# EAGLE schematic cs_v2.1 (EAGLE 9.6.1)

## Sheet 1 of 3
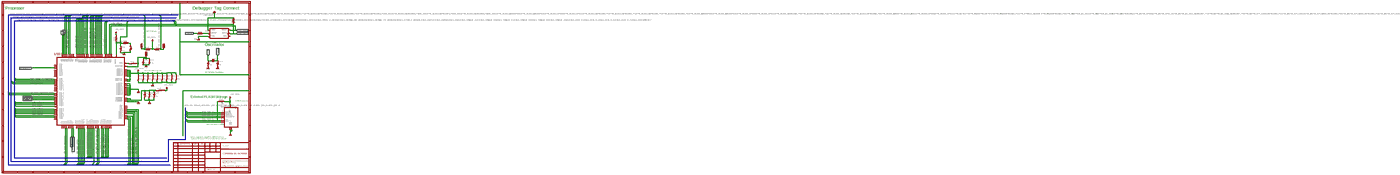
[diagram p0: schematic, sheet 1, overview]
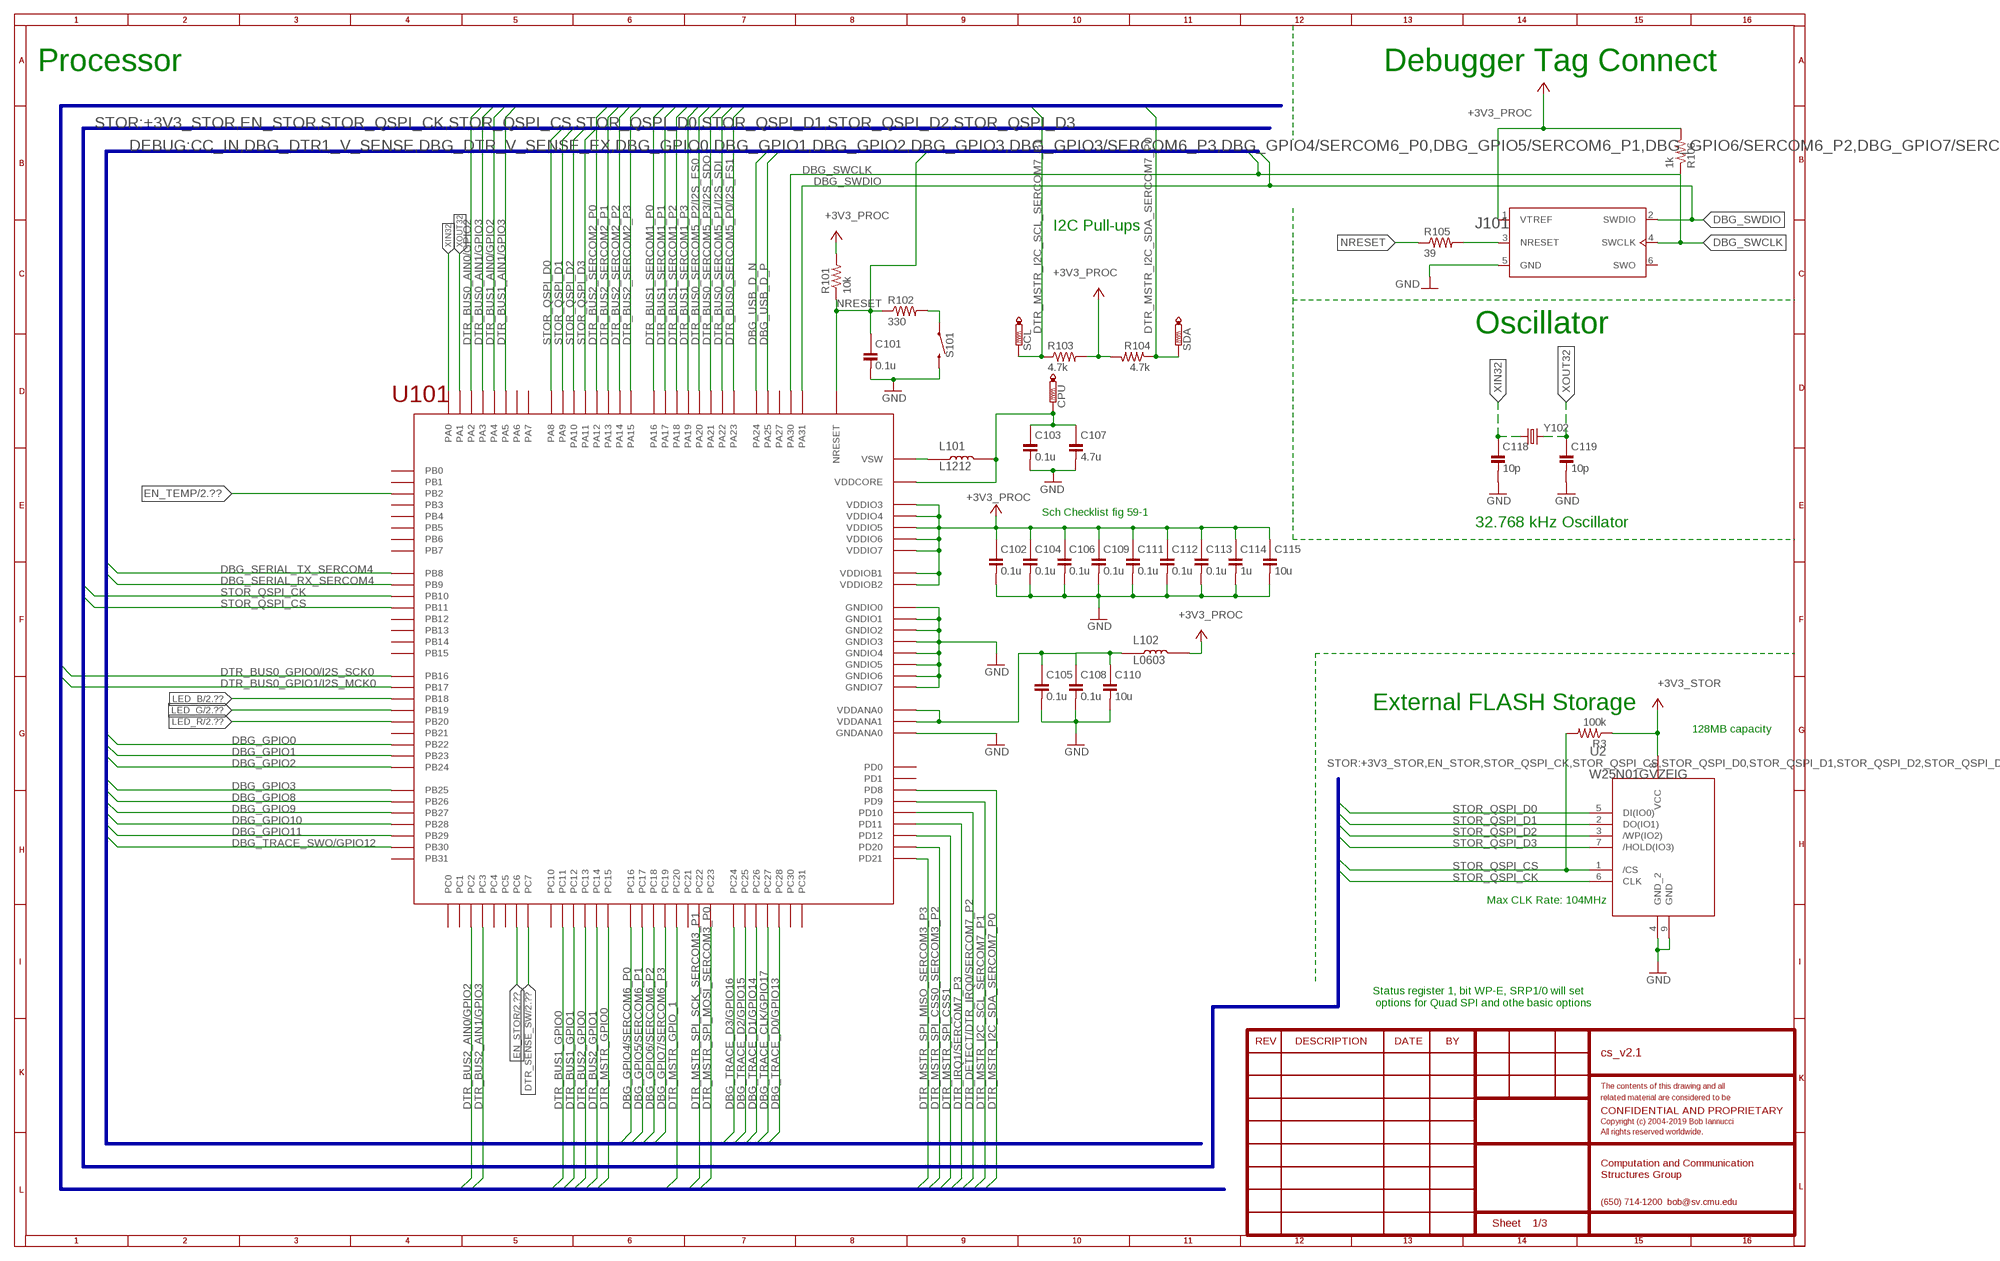
[diagram p1: schematic, sheet 1, part 1 of 4]
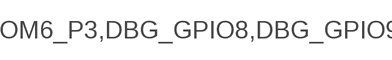
[diagram p2: schematic, sheet 1, part 2 of 4]
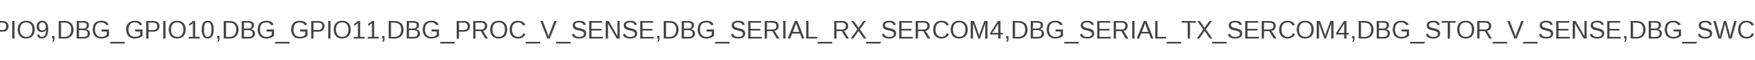
[diagram p3: schematic, sheet 1, part 3 of 4]
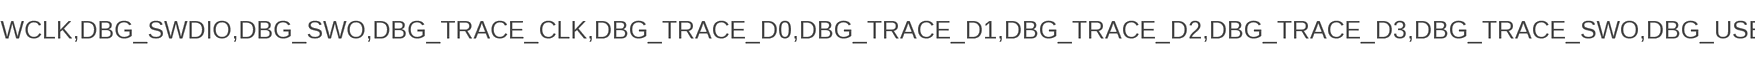
[diagram p4: schematic, sheet 1, part 4 of 4]

### Parts
C101  0.1u  C-0402  [C0402]
C102  0.1u  C-0402  [C0402]
C103  0.1u  C-0402  [C0402]
C104  0.1u  C-0402  [C0402]
C105  0.1u  C-0402  [C0402]
C106  0.1u  C-0402  [C0402]
C107  4.7u  C-0805  [C0805]
C108  0.1u  C-0402  [C0402]
C109  0.1u  C-0402  [C0402]
C110  10u  C-0805  [C0805]
C111  0.1u  C-0402  [C0402]
C112  0.1u  C-0402  [C0402]
C113  0.1u  C-0402  [C0402]
C114  1u  C-0402  [C0402]
C115  10u  C-0805  [C0805]
C118  10p  C-0402  [C0402]
C119  10p  C-0402  [C0402]
CPU  PTR1TP10SQ  [TP10SQ]
J101  J-JTAG-CORTEX-NEEDLE6-LEGS  [8.06.16_6-PIN_NEEDLE_ADAPTER_LEGS]
L101  L1212  [L1212]
L102  L0603  [L0603]
R3  100k  R-0402  [R0402]
R101  10k  R-0402  [R0402]
R102  330  R-0402  [R0402]
R103  4.7k  R-0402  [R0402]
R104  4.7k  R-0402  [R0402]
R105  39  R-0402  [R0402]
R106  1k  R-0402  [R0402]
S101  SW_EVQ-P7L01P_SPST_RA  [SW_EVQ-P7L01P]
SCL  PTR1TP10SQ  [TP10SQ]
SDA  PTR1TP10SQ  [TP10SQ]
U2  W25N01GVZEIG  [WSON-8_W15N]
U101  ATSAMD51  [TFBGA120]
Y102  ABS07-32.768KHZ-9-T  [XTAL320X150X90]

### Nets
+3V3_PROC: C102.1 C104.1 C106.1 C109.1 C111.1 C112.1 C113.1 C114.1 C115.1 J101.1(VTREF) L102.2 R101.2 R103.2 R104.2 R106.2 U101.VDDIO3 U101.VDDIO4 U101.VDDIO5 U101.VDDIO6 U101.VDDIO7 U101.VDDIOB1 U101.VDDIOB2 ; supply symbol labelled +3V3 ; also sheet 2
+3V3_STOR [power_3v3]: R3.1 U2.8(VCC) ; supply symbol labelled +3V3 ; also sheet 2
DBG_GPIO0: U101.PB22 ; also sheet 3
DBG_GPIO1: U101.PB23 ; also sheet 3
DBG_GPIO2: U101.PB24 ; also sheet 3
DBG_GPIO3: U101.PB25 ; also sheet 3
DBG_GPIO4/SERCOM6_P0: U101.PC16 ; also sheet 3
DBG_GPIO5/SERCOM6_P1: U101.PC17 ; also sheet 3
DBG_GPIO6/SERCOM6_P2: U101.PC18 ; also sheet 3
DBG_GPIO7/SERCOM6_P3: U101.PC19 ; also sheet 3
DBG_GPIO8: U101.PB26 ; also sheet 3
DBG_GPIO9: U101.PB27 ; also sheet 3
DBG_GPIO10: U101.PB28 ; also sheet 3
DBG_GPIO11: U101.PB29 ; also sheet 3
DBG_SERIAL_RX_SERCOM4: U101.PB09(PB9) ; also sheet 3
DBG_SERIAL_TX_SERCOM4: U101.PB08(PB8) ; also sheet 3
DBG_SWCLK: J101.4(SWCLK) R106.1 U101.PA30 ; also sheet 3
DBG_SWDIO: J101.2(SWDIO) U101.PA31 ; also sheet 3
DBG_TRACE_CLK/GPIO17: U101.PC27 ; also sheet 3
DBG_TRACE_D0/GPIO13: U101.PC28 ; also sheet 3
DBG_TRACE_D1/GPIO14: U101.PC26 ; also sheet 3
DBG_TRACE_D2/GPIO15: U101.PC25 ; also sheet 3
DBG_TRACE_D3/GPIO16: U101.PC24 ; also sheet 3
DBG_TRACE_SWO/GPIO12: U101.PB30 ; also sheet 3
DBG_USB_D_N [differential]: U101.PA24 ; also sheet 3
DBG_USB_D_P [differential]: U101.PA25 ; also sheet 3
DTR_BUS0_AIN0/GPIO2: U101.PA02(PA2) ; also sheet 3
DTR_BUS0_AIN1/GPIO3: U101.PA03(PA3) ; also sheet 3
DTR_BUS0_GPIO0/I2S_SCK0: U101.PB16 ; also sheet 3
DTR_BUS0_GPIO1/I2S_MCK0: U101.PB17 ; also sheet 3
DTR_BUS0_SERCOM5_P0/I2S_FS1: U101.PA23 ; also sheet 3
DTR_BUS0_SERCOM5_P1/I2S_SDI: U101.PA22 ; also sheet 3
DTR_BUS0_SERCOM5_P2/I2S_FS0: U101.PA20 ; also sheet 3
DTR_BUS0_SERCOM5_P3/I2S_SDO: U101.PA21 ; also sheet 3
DTR_BUS1_AIN0/GPIO2: U101.PA04(PA4) ; also sheet 3
DTR_BUS1_AIN1/GPIO3: U101.PA05(PA5) ; also sheet 3
DTR_BUS1_GPIO0: U101.PC11 ; also sheet 3
DTR_BUS1_GPIO1: U101.PC12 ; also sheet 3
DTR_BUS1_SERCOM1_P0: U101.PA16 ; also sheet 3
DTR_BUS1_SERCOM1_P1: U101.PA17 ; also sheet 3
DTR_BUS1_SERCOM1_P2: U101.PA18 ; also sheet 3
DTR_BUS1_SERCOM1_P3: U101.PA19 ; also sheet 3
DTR_BUS2_AIN0/GPIO2: U101.PC02(PC2) ; also sheet 3
DTR_BUS2_AIN1/GPIO3: U101.PC03(PC3) ; also sheet 3
DTR_BUS2_GPIO0: U101.PC13 ; also sheet 3
DTR_BUS2_GPIO1: U101.PC14 ; also sheet 3
DTR_BUS2_SERCOM2_P0: U101.PA12 ; also sheet 3
DTR_BUS2_SERCOM2_P1: U101.PA13 ; also sheet 3
DTR_BUS2_SERCOM2_P2: U101.PA14 ; also sheet 3
DTR_BUS2_SERCOM2_P3: U101.PA15 ; also sheet 3
DTR_DETECT/DTR_IRQ0/SERCOM7_P2: U101.PD10 ; also sheet 3
DTR_IRQ1/SERCOM7_P3: U101.PD11 ; also sheet 3
DTR_MSTR_GPIO0: U101.PC15 ; also sheet 3
DTR_MSTR_GPIO_1: U101.PC20
DTR_MSTR_I2C_SCL_SERCOM7_P1: R103.1 SCL.TP U101.PD09(PD9) ; also sheet 2,3
DTR_MSTR_I2C_SDA_SERCOM7_P0: R104.1 SDA.TP U101.PD08(PD8) ; also sheet 2,3
DTR_MSTR_SPI_CSS0_SERCOM3_P2: U101.PD20 ; also sheet 3
DTR_MSTR_SPI_CSS1: U101.PD12 ; also sheet 3
DTR_MSTR_SPI_MISO_SERCOM3_P3: U101.PD21 ; also sheet 3
DTR_MSTR_SPI_MOSI_SERCOM3_P0: U101.PC23 ; also sheet 3
DTR_MSTR_SPI_SCK_SERCOM3_P1: U101.PC22 ; also sheet 3
DTR_SENSE_SW: U101.PC07(PC7) ; also sheet 2
EN_STOR: U101.PC06(PC6) ; also sheet 2
EN_TEMP: U101.PB02(PB2) ; also sheet 2
GND: C101.2 C102.2 C103.2 C104.2 C105.2 C106.2 C107.2 C108.2 C109.2 C110.2 C111.2 C112.2 C113.2 C114.2 C115.2 C118.2 C119.2 J101.5(GND) S101.2_1 S101.2_2 U2.4(GND_2) U2.9(GND) U101.GNDANA0 U101.GNDIO0 U101.GNDIO1 U101.GNDIO2 U101.GNDIO3 U101.GNDIO4 U101.GNDIO5 U101.GNDIO6 U101.GNDIO7 ; also sheet 2,3
JTAG_NRESET: J101.3(NRESET) R105.2
LED_B: U101.PB18 ; also sheet 2
LED_G: U101.PB19 ; also sheet 2
LED_R: U101.PB20 ; also sheet 2
N$5: R102.2 S101.1_1 S101.1_2
NRESET: C101.1 R101.1 R102.1 R105.1 U101.NRESET ; also sheet 3
STOR_QSPI_CK: U2.6(CLK) U101.PB10
STOR_QSPI_CS: R3.2 U2.1(/CS) U101.PB11
STOR_QSPI_D0: U2.5(DI(IO0)) U101.PA08(PA8)
STOR_QSPI_D1: U2.2(DO(IO1)) U101.PA09(PA9)
STOR_QSPI_D2: U2.3(/WP(IO2)) U101.PA10
STOR_QSPI_D3: U2.7(/HOLD(IO3)) U101.PA11
VDDANA: C105.1 C108.1 C110.1 L102.1 U101.VDDANA0 U101.VDDANA1
VDDCORE: C103.1 C107.1 CPU.TP L101.P$2 U101.VDDCORE
VSW: L101.P$1 U101.VSW
XIN32: C118.1 U101.PA00(PA0) Y102.1
XOUT32: C119.1 U101.PA01(PA1) Y102.2
Unconnected: J101.6(SWO) U101.PA06(PA6) U101.PA07(PA7) U101.PA27 U101.PB00(PB0) U101.PB01(PB1) U101.PB03(PB3) U101.PB04(PB4) U101.PB05(PB5) U101.PB06(PB6) U101.PB07(PB7) U101.PB12 U101.PB13 U101.PB14 U101.PB15 U101.PB21 U101.PB31 U101.PC00(PC0) U101.PC01(PC1) U101.PC04(PC4) U101.PC05(PC5) U101.PC10 U101.PC21 U101.PC30 U101.PC31 U101.PD00(PD0) U101.PD01(PD1)

### Buses
STOR:+3V3_STOR,EN_STOR,STOR_QSPI_CK,STOR_QSPI_CS,STOR_QSPI_D0,STOR_QSPI_D1,STOR_QSPI_D2,STOR_QSPI_D3
DTR:+3V3_DTR,+3V3_DTR_SENSE-,DTR,DTR_BUS0_AIN0/GPIO2,DTR_BUS0_AIN1/GPIO3,DTR_BUS0_GPIO0,DTR_BUS0_GPIO0/I2S_SCK0,DTR_BUS0_GPIO1,DTR_BUS0_GPIO1/I2S_MCK0,DTR_BUS0_GPIO4/I2S_SCK1,DTR_BUS0_GPIO5/I2S_MCK1,DTR_BUS0_SERCOM0_P0,DTR_BUS0_SERCOM0_P1,DTR_BUS0_SERCOM0_P2,DTR_BUS0_SERCOM0_P3,DTR_BUS0_SERCOM5_P0/I2S_FS1,DTR_BUS0_SERCOM5_P1/I2S_SDI,DTR_BUS0_SERCOM5_P2/I2S_FS0,DTR_BUS0_SERCOM5_P3/I2S_SDO,DTR_BUS1_AIN0/GPIO2,DTR_BUS1_AIN1/GPIO3,DTR_BUS1_GPIO0,DTR_BUS1_GPIO1,DTR_BUS1_SERCOM1_P0,DTR_BUS1_SERCOM1_P1,DTR_BUS1_SERCOM1_P2,DTR_BUS1_SERCOM1_P3,DTR_BUS2_AIN0/GPIO2,DTR_BUS2_AIN1/GPIO3,DTR_BUS2_GPIO0,DTR_BUS2_GPIO1,DTR_BUS2_SERCOM2_P0,DTR_BUS2_SERCOM2_P1,DTR_BUS2_SERCOM2_P2,DTR_BUS2_SERCOM2_P3,DTR_BUS3_AIN0,DTR_BUS3_AIN1,DTR_BUS3_GPIO0,DTR_BUS3_GPIO1,DTR_DETECT/DTR_IRQ0,DTR_DETECT/DTR_IRQ0/SERCOM7_P2,DTR_DTR0_V_SENSE,DTR_IRQ1/SERCOM7_P3,DTR_MASTER_I2C_SCL,DTR_MASTER_I2C_SDA,DTR_MASTER_IRQ,DTR_MSTR_GPIO0,DTR_MSTR_GPIO_1,DTR_MSTR_I2C_SCL_SERCOM7_P1,DTR_MSTR_I2C_SDA_SERCOM7_P0,DTR_MSTR_SPI_CSS0_SERCOM3_P2,DTR_MSTR_SPI_CSS1,DTR_MSTR_SPI_MISO_SERCOM3_P3,DTR_MSTR_SPI_MOSI_SERCOM3_P0,DTR_MSTR_SPI_SCK_SERCOM3_P1,DTR_SENSE_SW
DEBUG:CC_IN,DBG_DTR1_V_SENSE,DBG_DTR_V_SENSE_EX,DBG_GPIO0,DBG_GPIO1,DBG_GPIO2,DBG_GPIO3,DBG_GPIO3/SERCOM6_P3,DBG_GPIO4/SERCOM6_P0,DBG_GPIO5/SERCOM6_P1,DBG_GPIO6/SERCOM6_P2,DBG_GPIO7/SERCOM6_P3,DBG_GPIO8,DBG_GPIO9,DBG_GPIO10,DBG_GPIO11,DBG_PROC_V_SENSE,DBG_SERIAL_RX_SERCOM4,DBG_SERIAL_TX_SERCOM4,DBG_STOR_V_SENSE,DBG_SWCLK,DBG_SWDIO,DBG_SWO,DBG_TRACE_CLK,DBG_TRACE_D0,DBG_TRACE_D1,DBG_TRACE_D2,DBG_TRACE_D3,DBG_TRACE_SWO,DBG_USB_D-,DBG_USB_D+,DBG_USB_D_N,DBG_USB_D_P,DBG_VDD,NRESET

### Notes on the sheet
- Processor | Debugger Tag Connect
- I2C Pull-ups
- Oscillator
- Sch Checklist fig 59-1
- 32.768 kHz Oscillator
- External FLASH Storage
- 128MB capacity
- Max CLK Rate: 104MHz
- Status register 1, bit WP-E, SRP1/0 will set
   options for Quad SPI and othe basic options

## Sheet 2 of 3
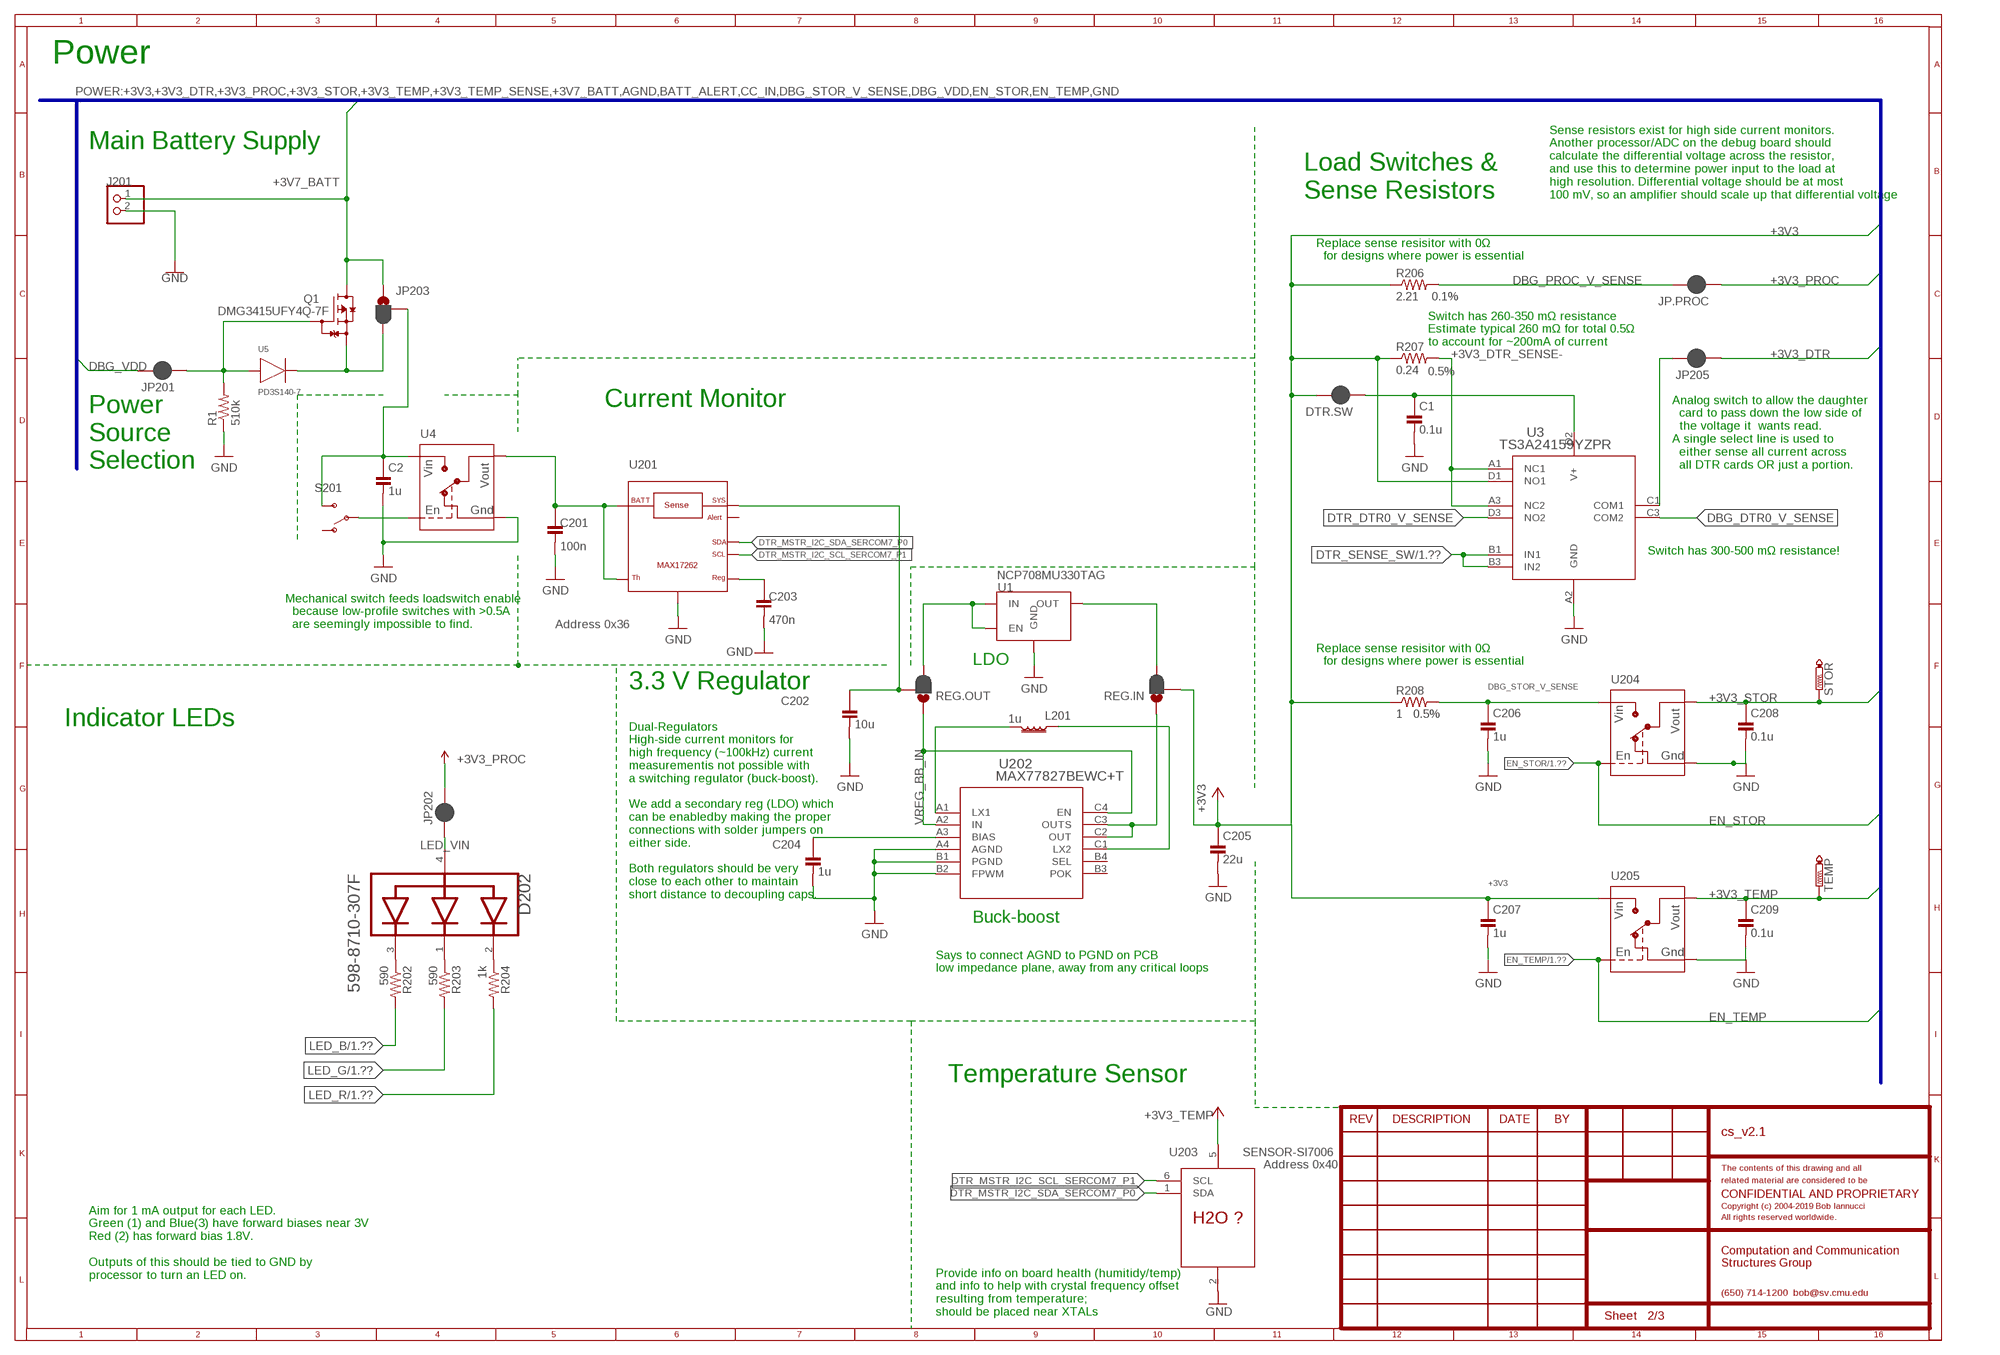
[diagram p5: schematic, sheet 2]

### Parts
C1  0.1u  C-0402  [C0402]
C2  1u  C-0402  [C0402]
C201  100n  C-0402  [C0402]
C202  10u  C-0603  [C0603]
C203  470n  C-0402  [C0402]
C204  1u  C-0402  [C0402]
C205  22u  C-0805  [C0805]
C206  1u  C-0402  [C0402]
C207  1u  C-0402  [C0402]
C208  0.1u  C-0402  [C0402]
C209  0.1u  C-0402  [C0402]
D202  DIALIGHT_RGBLED_598-8710-307FDIALIGHT_598-8710-307F_0_0  [DIALIGHT_0606_598-8710-307F_0]
DTR.SW  JUMPER-SMT_2_NC_PASTE_NO-SILK  [SMT-JUMPER_2_NC_PASTE_NO-SILK]
J201  J-JST2-SMT-RA  [JST-PH-2-SMT-RA]
JP201  JUMPER-SMT_2_NC_PASTE_NO-SILK  [SMT-JUMPER_2_NC_PASTE_NO-SILK]
JP202  JUMPER-SMT_2_NC_PASTE_NO-SILK  [SMT-JUMPER_2_NC_PASTE_NO-SILK]
JP203  JUMPER-SMT_3_1-NC_PASTE_NO-SILK  [SMT-JUMPER_3_1-NC_PASTE_NO-SILK]
JP205  JUMPER-SMT_2_NC_PASTE_NO-SILK  [SMT-JUMPER_2_NC_PASTE_NO-SILK]
JP.PROC  JUMPER-SMT_2_NC_PASTE_NO-SILK  [SMT-JUMPER_2_NC_PASTE_NO-SILK]
L201  1u  XAL40  [XAL40]
Q1  DMG3415UFY4Q-7F  [X2-DFN2015-3]
R1  510k  R-0402  [R0402]
R202  590  R-0402  [R0402]
R203  590  R-0402  [R0402]
R204  1k  R-0402  [R0402]
R206  2.21  R-0603  [R0603]
R207  0.24  R-0402  [R0402]
R208  1  R-0603  [R0603]
REG.IN  JUMPER-SMT_3_1-NC_PASTE_NO-SILK  [SMT-JUMPER_3_1-NC_PASTE_NO-SILK]
REG.OUT  JUMPER-SMT_3_1-NC_PASTE_NO-SILK  [SMT-JUMPER_3_1-NC_PASTE_NO-SILK]
S201  SLIDESWITCH-SPDT-SMD-RIGHT-ANGLE  [SWITCH_SPST_SMD_A]
STOR  PTR1TP10SQ  [TP10SQ]
TEMP  PTR1TP10SQ  [TP10SQ]
U1  NCP708MU330TAG  LDO_ONSEMI_NCP708  [UDFN6_NCP708]]
U3  TS3A24159YZPR  [DSBGA10]
U4  LOADSWITCH-MIC94164  [WLCSP6_2X3]
U5  PD3S140-7  [POWERDI323]
U201  COULOMB-MAX17262  [BGA9N40P3X3_144X146X69N]
U202  MAX77827BEWC+T  [12-WLP]
U203  SENSOR-SI7006  [DFN-06]
U204  LOADSWITCH-MIC94164  [WLCSP6_2X3]
U205  LOADSWITCH-MIC94164  [WLCSP6_2X3]

### Nets
+3V3 [power_3v3]: C205.1 C207.1 DTR.SW.2 R206.1 R207.1 R208.1 REG.IN.2 U3.D1(NO1) U205.A2(VIN) U205.B2(VIN) ; also sheet 3
+3V3_DTR [power_3v3]: JP205.1 ; also sheet 3
+3V3_DTR.SW: JP205.2 U3.C1(COM1)
+3V3_DTR_SENSE-: R207.2 U3.A1(NC1) U3.A3(NC2)
+3V3_PROC: JP202.2 JP.PROC.1 ; supply symbol labelled VIN ; also sheet 1
+3V3_STOR [power_3v3]: C208.1 STOR.TP U204.A1(VOUT) U204.B1(VOUT) ; also sheet 1
+3V3_TEMP: C209.1 TEMP.TP U203.5(V) U205.A1(VOUT) U205.B1(VOUT) ; supply symbol labelled +3V3
+3V7_BATT [power_3v3]: J201.1 JP203.1 Q1.3-1(D) Q1.3-2(D) ; also sheet 3
BB_LX1: L201.2 U202.A1(LX1)
BB_LX2: L201.1 U202.C1(LX2)
BB_REG_OUT [power_3v3]: REG.IN.1 U202.C2(OUT) U202.C3(OUTS)
CC_IN [power_3v3]: C201.1 U4.A1(VOUT) U4.B1(VOUT) U201.A1(TH) U201.A2(BATT)
DBG_DTR0_V_SENSE: U3.C3(COM2) ; also sheet 3
DBG_PROC_V_SENSE: JP.PROC.2 R206.2 ; also sheet 3
DBG_STOR_V_SENSE: C206.1 R208.2 U204.A2(VIN) U204.B2(VIN) ; also sheet 3
DBG_VDD [power_3v3]: JP201.2 ; also sheet 3
DTR_DTR0_V_SENSE: U3.D3(NO2) ; also sheet 3
DTR_MSTR_I2C_SCL_SERCOM7_P1: U201.B1(SCL) U203.6(SCL) ; also sheet 1,3
DTR_MSTR_I2C_SDA_SERCOM7_P0: U201.C1(SDA) U203.1(SDA) ; also sheet 1,3
DTR_SENSE_SW: U3.B1(IN1) U3.B3(IN2) ; also sheet 1
EN_STOR: U204.C2(ENABLE) ; also sheet 1
EN_TEMP: U205.C2(ENABLE) ; also sheet 1
GND: C1.2 C2.2 C201.2 C202.2 C203.2 C204.2 C205.2 C206.2 C207.2 C208.2 C209.2 J201.2 R1.1 U1.2(GND) U1.3(GND) U1.7(GND) U3.A2(GND) U4.C1(GND) U201.C3(GND) U202.A4(AGND) U202.B1(PGND) U202.B2(FPWM) U203.2(GND) U204.C1(GND) U205.C1(GND) ; also sheet 1,3
LDO_REG_OUT: REG.IN.3 U1.4(OUT) U1.5(OUT)
LED_B: R202.2 ; also sheet 1
LED_G: R203.2 ; also sheet 1
LED_R: R204.2 ; also sheet 1
LED_VIN: D202.4(COMMON_ANODE) JP202.1
N$2: JP203.3 Q1.2(S) U5.2(N)
N$4: D202.3(BLUE_CATHODE) R202.1
N$12: D202.1(GREEN_CATHODE) R203.1
N$13: C203.1 U201.C2(REG)
N$14: D202.2(RED_CATHODE) R204.1
N$17 [power_3v3]: C1.1 DTR.SW.1 U3.D2(V+)
REG_LDO_IN: REG.OUT.3 U1.1(EN) U1.6(IN)
V.SRC: C2.1 JP203.2 S201.3(S) U4.A2(VIN) U4.B2(VIN)
V.SRC.EN: S201.2(P) U4.C2(ENABLE)
V_SEL_IN_B [power_3v3]: JP201.1 Q1.1(G) R1.2 U5.1(P)
VREG_BB_IN [power_3v3]: REG.OUT.1 U202.A2(IN) U202.C4(EN)
VREG_BIAS: C204.1 U202.A3(BIAS)
VREG_IN [power_3v3]: C202.1 REG.OUT.2 U201.B3(SYS)
Unconnected: S201.1(O) U201.B2(ALRT) U202.B3(POK) U202.B4(SEL)

### Buses
POWER:+3V3,+3V3_DTR,+3V3_PROC,+3V3_STOR,+3V3_TEMP,+3V3_TEMP_SENSE,+3V7_BATT,AGND,BATT_ALERT,CC_IN,DBG_STOR_V_SENSE,DBG_VDD,EN_STOR,EN_TEMP,GND

### Notes on the sheet
- Power
- Main Battery Supply
- Load Switches &
  Sense Resistors
- Sense resistors exist for high side current monitors.
  Another processor/ADC on the debug board should
  calculate the differential voltage across the resistor, 
  and use this to determine power input to the load at
  high resolution. Differential voltage should be at most 
  100 mV, so an amplifier should scale up that differential voltage
- Replace sense resisitor with 0Ω
    for designs where power is essential
- Switch has 260-350 mΩ resistance
  Estimate typical 260 mΩ for total 0.5Ω
  to account for ~200mA of current
- Current Monitor
- Power 
  Source
  Selection
- Analog switch to allow the daughter 
    card to pass down the low side of 
    the voltage it  wants read. 
  A single select line is used to 
    either sense all current across
    all DTR cards OR just a portion.
- Switch has 300-500 mΩ resistance!
- Mechanical switch feeds loadswitch enable
    because low-profile switches with >0.5A
    are seemingly impossible to find.
- Address 0x36
- LDO
- Replace sense resisitor with 0Ω
    for designs where power is essential
- 3.3 V Regulator
- Indicator LEDs
- Dual-Regulators
  High-side current monitors for 
  high frequency (~100kHz) current 
  measurementis not possible with 
  a switching regulator (buck-boost).
  
  We add a secondary reg (LDO) which 
  can be enabledby making the proper 
  connections with solder jumpers on 
  either side.
  
  Both regulators should be very 
  close to each other to maintain 
  short distance to decoupling caps.
- Buck-boost
- Says to connect AGND to PGND on PCB
  low impedance plane, away from any critical loops
- Temperature Sensor
- Address 0x40
- Aim for 1 mA output for each LED.
  Green (1) and Blue(3) have forward biases near 3V
  Red (2) has forward bias 1.8V.
  
  Outputs of this should be tied to GND by 
  processor to turn an LED on.
- Provide info on board health (humitidy/temp) 
  and info to help with crystal frequency offset
  resulting from temperature; 
  should be placed near XTALs

## Sheet 3 of 3
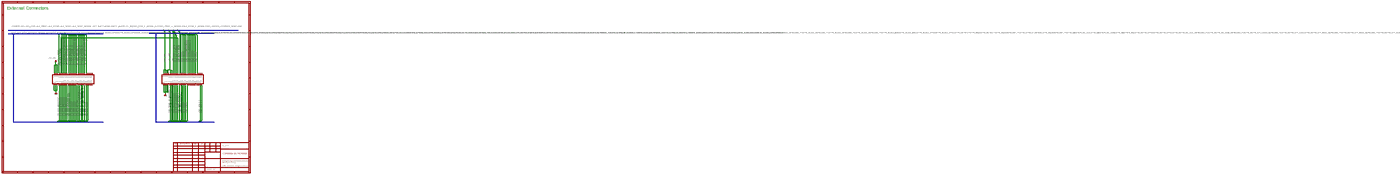
[diagram p6: schematic, sheet 3, overview]
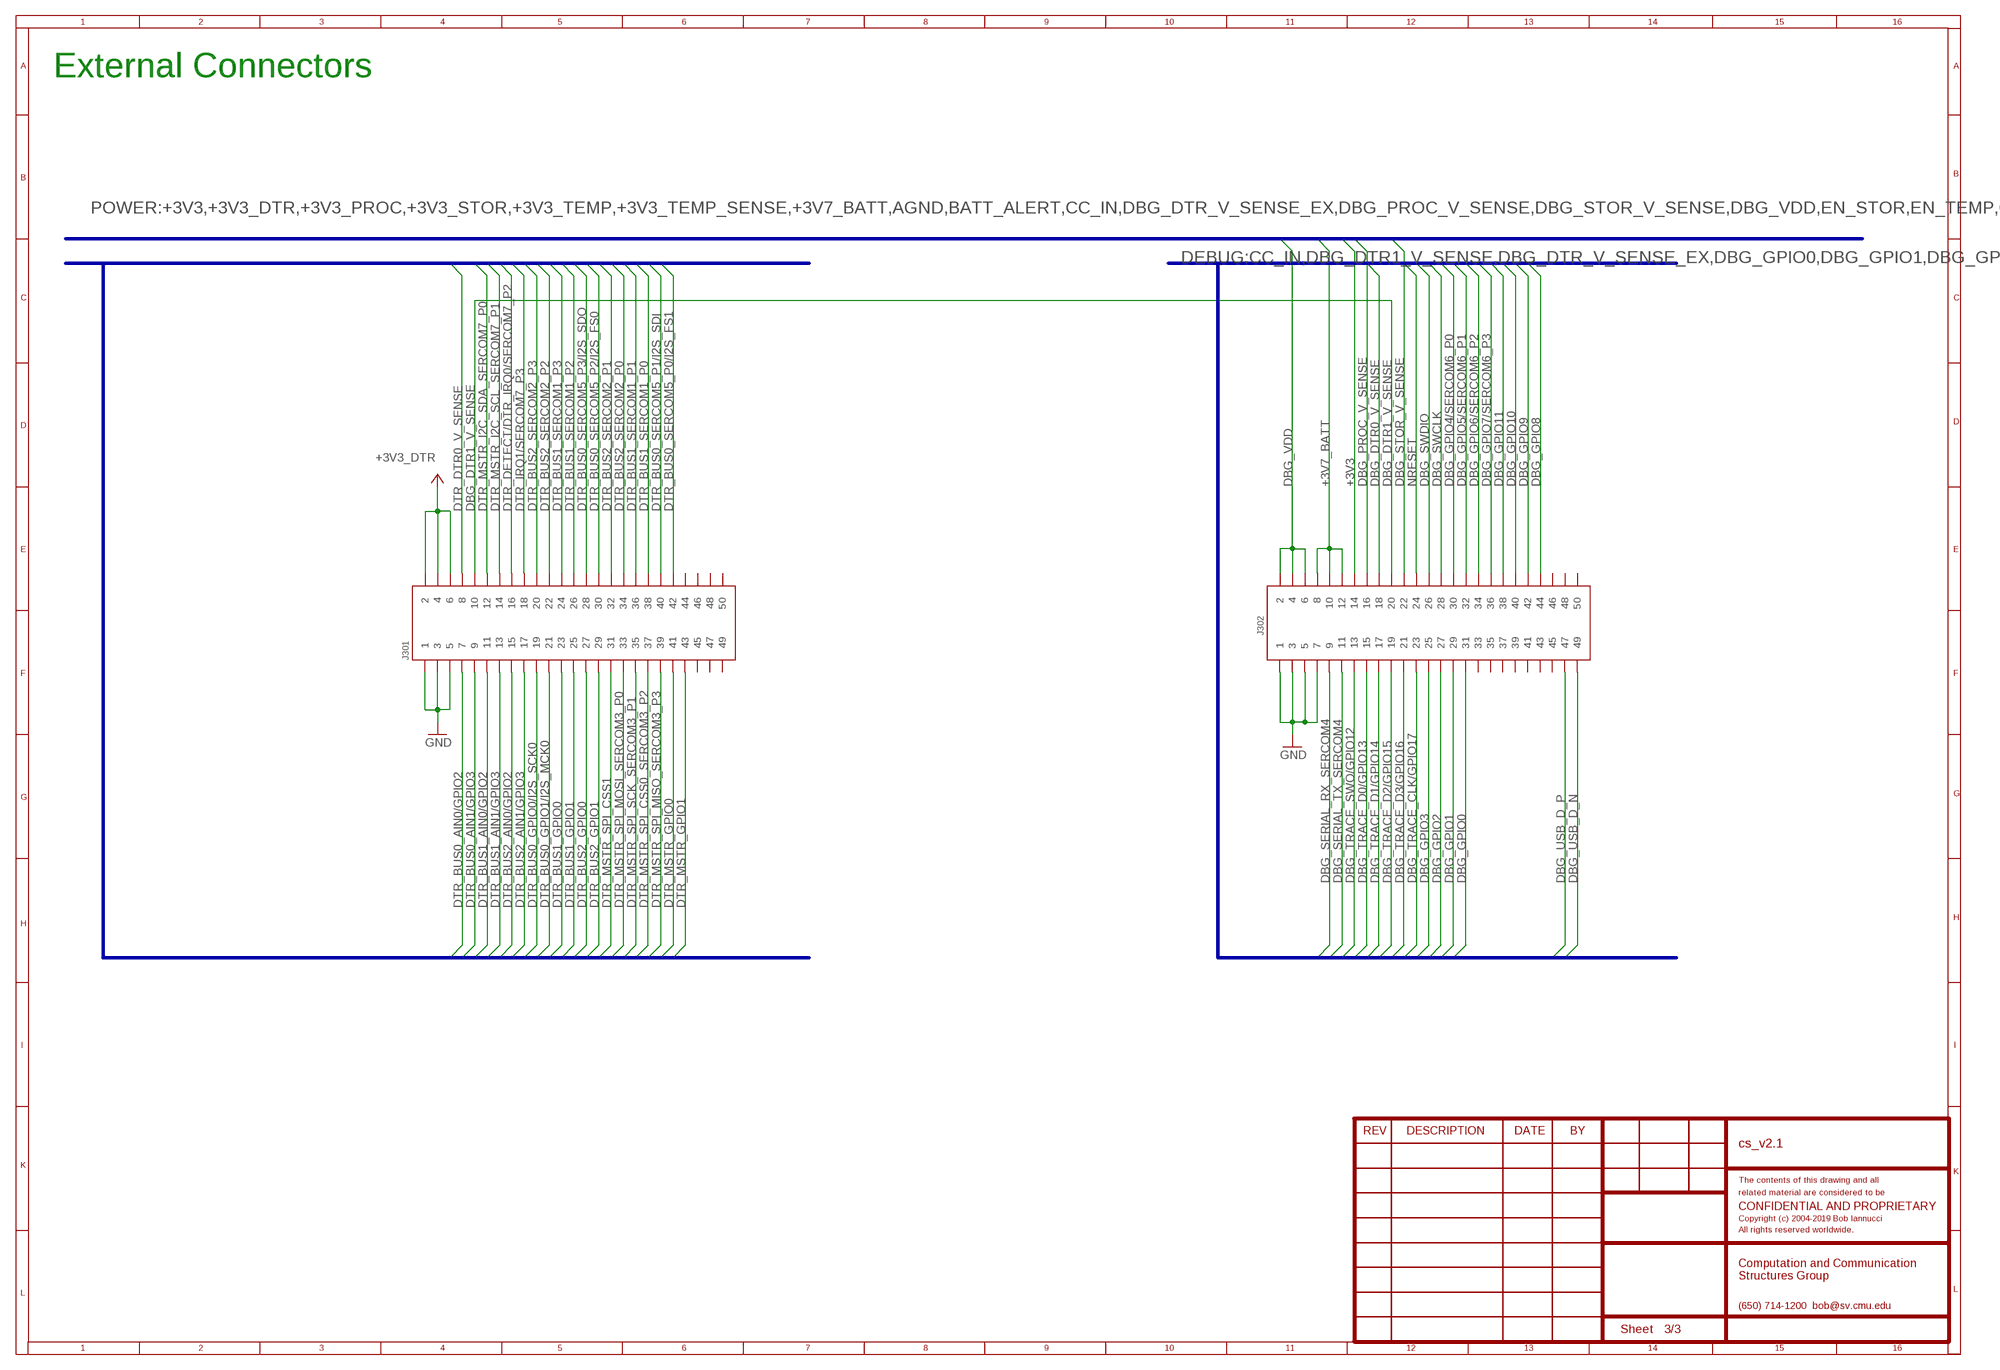
[diagram p7: schematic, sheet 3, part 1 of 4]
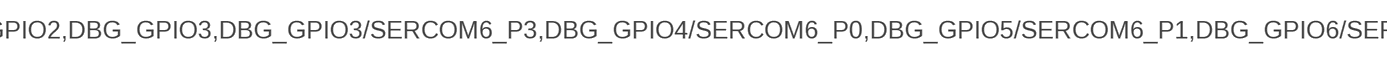
[diagram p8: schematic, sheet 3, part 2 of 4]
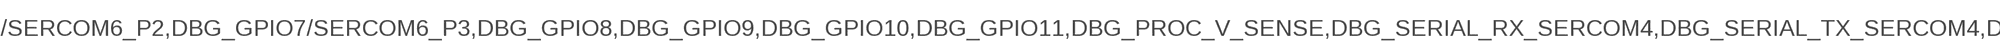
[diagram p9: schematic, sheet 3, part 3 of 4]
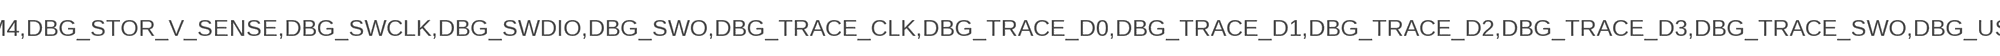
[diagram p10: schematic, sheet 3, part 4 of 4]

### Parts
J301  HIROSE-DF40_50-PIN_CONNECTORS-RECEPTACLE  [HRS_DF40HC(4.0)-50DS-0.4V(51)]
J302  HIROSE-DF40_50-PIN_CONNECTORS-RECEPTACLE  [HRS_DF40HC(4.0)-50DS-0.4V(51)]

### Nets
+3V3 [power_3v3]: J302.14 ; also sheet 2
+3V3_DTR [power_3v3]: J301.2 J301.4 J301.6 ; supply symbol labelled +3V3 ; also sheet 2
+3V7_BATT [power_3v3]: J302.8 J302.10 J302.12 ; also sheet 2
DBG_DTR0_V_SENSE: J302.18 ; also sheet 2
DBG_DTR1_V_SENSE: J301.10 J302.20
DBG_GPIO0: J302.31 ; also sheet 1
DBG_GPIO1: J302.29 ; also sheet 1
DBG_GPIO2: J302.27 ; also sheet 1
DBG_GPIO3: J302.25 ; also sheet 1
DBG_GPIO4/SERCOM6_P0: J302.30 ; also sheet 1
DBG_GPIO5/SERCOM6_P1: J302.32 ; also sheet 1
DBG_GPIO6/SERCOM6_P2: J302.34 ; also sheet 1
DBG_GPIO7/SERCOM6_P3: J302.36 ; also sheet 1
DBG_GPIO8: J302.44 ; also sheet 1
DBG_GPIO9: J302.42 ; also sheet 1
DBG_GPIO10: J302.40 ; also sheet 1
DBG_GPIO11: J302.38 ; also sheet 1
DBG_PROC_V_SENSE: J302.16 ; also sheet 2
DBG_SERIAL_RX_SERCOM4: J302.9 ; also sheet 1
DBG_SERIAL_TX_SERCOM4: J302.11 ; also sheet 1
DBG_STOR_V_SENSE: J302.22 ; also sheet 2
DBG_SWCLK: J302.28 ; also sheet 1
DBG_SWDIO: J302.26 ; also sheet 1
DBG_TRACE_CLK/GPIO17: J302.23 ; also sheet 1
DBG_TRACE_D0/GPIO13: J302.15 ; also sheet 1
DBG_TRACE_D1/GPIO14: J302.17 ; also sheet 1
DBG_TRACE_D2/GPIO15: J302.19 ; also sheet 1
DBG_TRACE_D3/GPIO16: J302.21 ; also sheet 1
DBG_TRACE_SWO/GPIO12: J302.13 ; also sheet 1
DBG_USB_D_N [differential]: J302.49 ; also sheet 1
DBG_USB_D_P [differential]: J302.47 ; also sheet 1
DBG_VDD [power_3v3]: J302.2 J302.4 J302.6 ; also sheet 2
DTR_BUS0_AIN0/GPIO2: J301.7 ; also sheet 1
DTR_BUS0_AIN1/GPIO3: J301.9 ; also sheet 1
DTR_BUS0_GPIO0/I2S_SCK0: J301.19 ; also sheet 1
DTR_BUS0_GPIO1/I2S_MCK0: J301.21 ; also sheet 1
DTR_BUS0_SERCOM5_P0/I2S_FS1: J301.42 ; also sheet 1
DTR_BUS0_SERCOM5_P1/I2S_SDI: J301.40 ; also sheet 1
DTR_BUS0_SERCOM5_P2/I2S_FS0: J301.30 ; also sheet 1
DTR_BUS0_SERCOM5_P3/I2S_SDO: J301.28 ; also sheet 1
DTR_BUS1_AIN0/GPIO2: J301.11 ; also sheet 1
DTR_BUS1_AIN1/GPIO3: J301.13 ; also sheet 1
DTR_BUS1_GPIO0: J301.23 ; also sheet 1
DTR_BUS1_GPIO1: J301.25 ; also sheet 1
DTR_BUS1_SERCOM1_P0: J301.38 ; also sheet 1
DTR_BUS1_SERCOM1_P1: J301.36 ; also sheet 1
DTR_BUS1_SERCOM1_P2: J301.26 ; also sheet 1
DTR_BUS1_SERCOM1_P3: J301.24 ; also sheet 1
DTR_BUS2_AIN0/GPIO2: J301.15 ; also sheet 1
DTR_BUS2_AIN1/GPIO3: J301.17 ; also sheet 1
DTR_BUS2_GPIO0: J301.27 ; also sheet 1
DTR_BUS2_GPIO1: J301.29 ; also sheet 1
DTR_BUS2_SERCOM2_P0: J301.34 ; also sheet 1
DTR_BUS2_SERCOM2_P1: J301.32 ; also sheet 1
DTR_BUS2_SERCOM2_P2: J301.22 ; also sheet 1
DTR_BUS2_SERCOM2_P3: J301.20 ; also sheet 1
DTR_DETECT/DTR_IRQ0/SERCOM7_P2: J301.16 ; also sheet 1
DTR_DTR0_V_SENSE: J301.8 ; also sheet 2
DTR_IRQ1/SERCOM7_P3: J301.18 ; also sheet 1
DTR_MSTR_GPIO0: J301.41 ; also sheet 1
DTR_MSTR_GPIO1: J301.43
DTR_MSTR_I2C_SCL_SERCOM7_P1: J301.14 ; also sheet 1,2
DTR_MSTR_I2C_SDA_SERCOM7_P0: J301.12 ; also sheet 1,2
DTR_MSTR_SPI_CSS0_SERCOM3_P2: J301.37 ; also sheet 1
DTR_MSTR_SPI_CSS1: J301.31 ; also sheet 1
DTR_MSTR_SPI_MISO_SERCOM3_P3: J301.39 ; also sheet 1
DTR_MSTR_SPI_MOSI_SERCOM3_P0: J301.33 ; also sheet 1
DTR_MSTR_SPI_SCK_SERCOM3_P1: J301.35 ; also sheet 1
GND: J301.1 J301.3 J301.5 J302.1 J302.3 J302.5 J302.7 ; also sheet 1,2
NRESET: J302.24 ; also sheet 1
Unconnected: J301.44 J301.45 J301.46 J301.47 J301.48 J301.49 J301.50 J302.33 J302.35 J302.37 J302.39 J302.41 J302.43 J302.45 J302.46 J302.48 J302.50

### Buses
POWER:+3V3,+3V3_DTR,+3V3_PROC,+3V3_STOR,+3V3_TEMP,+3V3_TEMP_SENSE,+3V7_BATT,AGND,BATT_ALERT,CC_IN,DBG_DTR_V_SENSE_EX,DBG_PROC_V_SENSE,DBG_STOR_V_SENSE,DBG_VDD,EN_STOR,EN_TEMP,GND
DTR:+3V3_DTR,+3V3_DTR_SENSE-,DTR,DTR_BUS0_AIN0/GPIO2,DTR_BUS0_AIN1/GPIO3,DTR_BUS0_GPIO0,DTR_BUS0_GPIO0/I2S_SCK0,DTR_BUS0_GPIO1,DTR_BUS0_GPIO1/I2S_MCK0,DTR_BUS0_GPIO4/I2S_SCK1,DTR_BUS0_GPIO5/I2S_MCK1,DTR_BUS0_SERCOM0_P0,DTR_BUS0_SERCOM0_P1,DTR_BUS0_SERCOM0_P2,DTR_BUS0_SERCOM0_P3,DTR_BUS0_SERCOM5_P0/I2S_FS1,DTR_BUS0_SERCOM5_P1/I2S_SDI,DTR_BUS0_SERCOM5_P2/I2S_FS0,DTR_BUS0_SERCOM5_P3/I2S_SDO,DTR_BUS1_AIN0/GPIO2,DTR_BUS1_AIN1/GPIO3,DTR_BUS1_GPIO0,DTR_BUS1_GPIO1,DTR_BUS1_SERCOM1_P0,DTR_BUS1_SERCOM1_P1,DTR_BUS1_SERCOM1_P2,DTR_BUS1_SERCOM1_P3,DTR_BUS2_AIN0/GPIO2,DTR_BUS2_AIN1/GPIO3,DTR_BUS2_GPIO0,DTR_BUS2_GPIO1,DTR_BUS2_SERCOM2_P0,DTR_BUS2_SERCOM2_P1,DTR_BUS2_SERCOM2_P2,DTR_BUS2_SERCOM2_P3,DTR_BUS3_AIN0,DTR_BUS3_AIN1,DTR_BUS3_GPIO0,DTR_BUS3_GPIO1,DTR_DETECT/DTR_IRQ0,DTR_DETECT/DTR_IRQ0/SERCOM7_P2,DTR_DTR0_V_SENSE,DTR_IRQ1/SERCOM7_P3,DTR_MASTER_I2C_SCL,DTR_MASTER_I2C_SDA,DTR_MASTER_IRQ,DTR_MSTR_GPIO0,DTR_MSTR_GPIO1,DTR_MSTR_I2C_SCL_SERCOM7_P1,DTR_MSTR_I2C_SDA_SERCOM7_P0,DTR_MSTR_SPI_CSS0_SERCOM3_P2,DTR_MSTR_SPI_CSS1,DTR_MSTR_SPI_MISO_SERCOM3_P3,DTR_MSTR_SPI_MOSI_SERCOM3_P0,DTR_MSTR_SPI_SCK_SERCOM3_P1,DTR_SENSE_SW
DEBUG:CC_IN,DBG_DTR1_V_SENSE,DBG_DTR_V_SENSE_EX,DBG_GPIO0,DBG_GPIO1,DBG_GPIO2,DBG_GPIO3,DBG_GPIO3/SERCOM6_P3,DBG_GPIO4/SERCOM6_P0,DBG_GPIO5/SERCOM6_P1,DBG_GPIO6/SERCOM6_P2,DBG_GPIO7/SERCOM6_P3,DBG_GPIO8,DBG_GPIO9,DBG_GPIO10,DBG_GPIO11,DBG_PROC_V_SENSE,DBG_SERIAL_RX_SERCOM4,DBG_SERIAL_TX_SERCOM4,DBG_STOR_V_SENSE,DBG_SWCLK,DBG_SWDIO,DBG_SWO,DBG_TRACE_CLK,DBG_TRACE_D0,DBG_TRACE_D1,DBG_TRACE_D2,DBG_TRACE_D3,DBG_TRACE_SWO,DBG_USB_D-,DBG_USB_D+,DBG_USB_D_N,DBG_USB_D_P,DBG_VDD,NRESET

### Notes on the sheet
- External Connectors

## Library data of the parts
C1 C101-C106 C108 C109 C111-C113 C208 C209 = Capacitors:C-: Capacitor, Surface Mount; MANUFACTURER: Kemet; PART_NO: C0402C104K8RACTU; TC: X7R; TOL: 10%; VOLTAGE: 10V
C2 C206 C207 = Capacitors:C-: Capacitor, Surface Mount; MANUFACTURER: Kemet; PART_NO: C0402C105M8PACTU; TC: X5R; TOL: 10%; VOLTAGE: 10V
C107 = Capacitors:C-: Capacitor, Surface Mount; MANUFACTURER: Kemet; PART_NO: C0805C475K8RACTU; TC: X7R; TOL: 10%; VOLTAGE: 10V
C110 C115 = Capacitors:C-: Capacitor, Surface Mount; MANUFACTURER: Kemet; PART_NO: C0805C106M8RACTU; TC: X7R; TOL: 10%; VOLTAGE: 10V
C114 C204 = Capacitors:C-: Capacitor, Surface Mount; MANUFACTURER: Kemet; MP: C0402C105M8PACTU; MPN: C0402C105M8PACTU; PART_NO: C0402C105M8PACTU; TC: X5R; TOL: 10%; VOLTAGE: 10V
C118 C119 = Capacitors:C-: Capacitor, Surface Mount; MANUFACTURER: Kemet; PART_NO: C0402C100C8GACTU; TC: X7R; TOL: 10%; VOLTAGE: 6.3V
C201 = Capacitors:C-: Capacitor, Surface Mount; MANUFACTURER: Kemet; MP: CC0402KRX5R5BB104; PART_NO: CC0402KRX5R5BB104; TC: X7R; TOL: 10%; VOLTAGE: 6.3V
C202 = Capacitors:C-: Capacitor, Surface Mount; MANUFACTURER: Kemet; PART_NO: C0603C106M8PAC7867; TC: X5R; TOL: 10%; VOLTAGE: 10V
C203 = Capacitors:C-: Capacitor, Surface Mount; MANUFACTURER: Kemet; MP: CC0402KRX5R5BB474; PART_NO: CC0402KRX5R5BB474; TC: X7R; TOL: 10%; VOLTAGE: 6.3V
C205 = Capacitors:C-: Capacitor, Surface Mount; MANUFACTURER: Kemet; PART_NO: C0805C226M8PAC7800; TC: X5R; TOL: 10%; VOLTAGE: 10V
CPU SCL SDA STOR TEMP = TestPoints:PTR1: Test point
D202 = Diodes:DIALIGHT_RGBLED_598-8710-307F: Micro LED; CENTROID_NOT_SPECIFIED: No; DATASHEET: https://media.digikey.com/pdf/Data%20Sheets/Dialight%20PDFs/598_Series_0606_Pkg.pdf; DIGIKEY_DESCRIPTION: DIODE LED RGB CLEAR 0606 SMD; DIGIKEY_PART_NUMBER: 350-2096-1-ND; LEAD_FREE: yes; MF: Dialight; MOUSER_PART_NUMBER: 645-598-8710-307F; MPN: 598-8710-307F; PACKAGE: LED_SMD; PART_NO: 598-8710-307F; PREFIX: D; ROHS: yes; TEMPERATURE_RANGE_HIGH: +100°C; TEMPERATURE_RANGE_LOW: -40°C
DTR.SW JP201 JP202 JP205 JP.PROC = Connectors:JUMPER-SMT_2_NC_PASTE: Normally closed solder jumper This jumper has an aperture in the stencil to allow solder paste to bridge the split in the wire so it's normally closed (NC). Wick off the solder to open the connection. Reapply solder to reclose the connection.; BOM: EXCLUDE
J101 = Connectors:J-JTAG-CORTEX-NEEDLE6: Adaptor, j-Link To Pcb, 6 Pin Needle Design verified by Reese
J201 = Connectors:J-JST2: JST 2-Pin Connector SMT-RA (S2B-PH-SM4) 4UConnector #17311 SMT (B2B-PH-SM4) THM-RA (S2B-PH) THM (B2B-PH) SMT-RA (SM02B-SRSS-TB) SH (1mm pitch) Connector; MANUFACTURER: JST Sales America Inc.; MPN: S2B-PH-SM4-TB(LF)(SN); PART_NO: S2B-PH-SM4-TB(LF)(SN)
J301 J302 = Connectors:HIROSE-DF40_50-PIN_CONNECTORS: Hirose DF40 series 50-pin mezzanine type connectors at 0.4mm pitch. Specification and Variants: https://www.hirose.com/product/document?clcode=&productname=&series=DF40&documenttype=Catalog&lang=en&documentid=D31649_en; MP: DF40HC(4.0)-50DS-0.4V(51); MPN: DF40HC(4.0)-50DS-0.4V(51); PART_NO: DF40HC(4.0)-50DS-0.4V(51)
JP203 REG.IN REG.OUT = SparkFun-Jumpers:JUMPER-SMT_3_1-NC_PASTE: Normally closed solder jumper (1 of 2 connections) This jumper has an aperture in the stencil to allow solder paste to bridge one of the two connections. One connection is normally closed (NC), while the other is normally open (NO). Wick off the solder to open the connection. Reapply solder to reclose the connection. Apply solder to the other side instead to change the current path.
L101 = Inductors:L1212: Datasheet for footprint: https://search.murata.co.jp/Ceramy/image/img/P02/JELF243A-0153.pdf; PART_NO: LQH3NPN100MMEL
L102 = Inductors:L0603; PART_NO: BLM18PG471SN1D
L201 = Inductors:XAL40: Coilcraft XAL40xx Shielded Power Inductor; MANUFACTURER: Coilcraft; MPN: XAL4020-102MEC; PART_NO: XAL4020-102MEC; SERIES: XAL40
Q1 = Switches:DMG3415UFY4Q-7: P-Channel MOSFET from Diodes Inc. Design verified by Reese; MP: DMG3415UFY4Q-7; MPN: DMG3415UFY4Q-7; PART_NO: DMG3415UFY4Q-7
R1 = Resistors:R-: Resistor, Surface Mount; MANUFACTURER: Panasonic; MP: ERJ-2GEJ514X; MPN: ERJ-2GEJ514X; PART_NO: ERJ-2GEJ514X; TOL: 5%
R3 = Resistors:R-: Resistor, Surface Mount; MANUFACTURER: Panasonic; MPN: ERJ-2GEJ104X; PART_NO: ERJ-2GEJ104X; TOL: 5%
R101 = Resistors:R-: Resistor, Surface Mount; MANUFACTURER: Panasonic; MPN: ERJ-2GEJ103X; PART_NO: ERJ-2GEJ103X; TOL: 5%
R102 = Resistors:R-: Resistor, Surface Mount; MANUFACTURER: Panasonic; PART_NO: ERJ-2GEJ331X; TOL: 5%
R103 R104 = Resistors:R-: Resistor, Surface Mount; MANUFACTURER: Panasonic; PART_NO: ERJ-2GEJ472X; TOL: 5%
R105 = Resistors:R-: Resistor, Surface Mount; MANUFACTURER: Panasonic; PART_NO: ERJ-2GEJ390X; TOL: 5%
R106 = Resistors:R-: Resistor, Surface Mount; MANUFACTURER: Panasonic; PART_NO: ERJ-2GEJ102X; TOL: 5%
R202 R203 = Resistors:R-: Resistor, Surface Mount; MANUFACTURER: Panasonic; PART_NO: ERJ-2RKF5900X; TOL: 1%
R204 = Resistors:R-: Resistor, Surface Mount; MANUFACTURER: Panasonic; PART_NO: ERA-2AED102X; TOL: 0.5%
R206 = Resistors:R-: Resistor, Surface Mount; MANUFACTURER: Stackpole; MPN: RNCF0603BKC2R21; PART_NO: RNCF0603BKC2R21; TOL: 0.1%
R207 = Resistors:R-: Resistor, Surface Mount; MANUFACTURER: Ohmite; MPN: KDV06DR240ET; PART_NO: KDV06DR240ET; TOL: 0.5%
R208 = Resistors:R-: Resistor, Surface Mount; MANUFACTURER: KOA Speer; MPN: KDV06DR510ET; PART_NO: SR732BTTD1R00D; TOL: 0.5%
S101 = Switches:SW_EVQ-P7L01P_SPST_RA: Switch Tactile N.O. SPST Rectangular Button Gull Wing 0.05A 12VDC 100000Cycle 1.6N SMD Embossed T/R; DESCRIPTION: Tactile Switch SPST-NO Side Actuated Surface Mount, Right Angle; MF: Panasonic; MP: EVQP7L01P; PART_NO: EVQP7L01P
S201 = Switches:SLIDESWITCH-SPDT: Single Pole, Double Throw (SPDT) Switch Single-pole, double-throw (SPDT) switch. Variant Overview SMD-AYZ0202 Surface Mount DPDT Switch (COM-00597) Used on e.g. LilyPad Arduino USB - ATmega32U4 Board PTH-11.6X4.0MM SPDT Mini Power Switch (COM-00102) Used on e.g. SparkFun Simon Says - Through-Hole Soldering Kit (KIT-10547) PTH-11.6X4.0MM-KIT KIT version of SPDT Mini Power Switch - Simplifies soldering by removing tStop of switch pins - only one side can be soldered. PTH-11.6X4.0MM-LOCK LOCK version of SPDT Mini Power Switch - Offset pins hold switch in place for easier soldering. SMD-RIGHT-ANGLE Surface Mount Right Angle Switch (COM-10860) Used on e.g. SparkFun ESP8266 Thing; MANUFACTURER: Nidec Copal Electronics; MPN: CUS-12TB; PART_NO: CUS-12TB
U1 = Regulators:LDO_ONSEMI_NCP708: Fixed Voltage 3.3V, 1A Low Dropout Regulator from ON Semi; CREATED-BY: CCSG-Reese; MANUFACTURER: ON Semiconductor; MP: NCP708MU330TAG; MPN: NCP708MU330TAG; PART_NO: NCP708MU330TAG
U2 = Storage:W25N01GVZEIG: 1 Gbit flash storage, programmable through SPI, Dual SPI or Quad SPI, manufactured by Winbond.; BUILT_BY: EMA_Cory; COPYRIGHT: Copyright (C) 2018 Accelerated Designs. All rights reserved; DATASHEET: https://www.winbond.com/resource-files/w25n01gv%20revl%20050918%20unsecured.pdf; MANUFACTURER_PART_NUMBER: W25N01GVZEIG TR; MP: W25N01GVZEIG TR; MPN: W25N01GVZEIG TR; PART_NO: W25N01GVZEIG TR; SOURCELIBRARY: Winbond_2020-02-06; VENDOR: Winbond
U3 = Switches:TS3A24159YZPR: Dual circuit SPDT Switch IC with very low on-resistance; DATASHEET_URL: http://www.ti.com/lit/gpn/TS3A24159; DESCRIPTION: 0.3 Ohm Dual SPDT Analog Switch Dual-Channel 2:1 Multiplexer/Demultiplexer; FAMILY_NAME: ANALOG SWITCH OR MULTIPLEXER (less than or equal to 5V); GENERIC_PART_NUMBER: TS3A24159; INDUSTRY_STD_PKG_TYPE: DSBGA; MANUFACTURER: Texas Instruments; MANUFACTURER_PART_NUMBER: TS3A24159YZPR; MP: TS3A24159YZPR; MPN: TS3A24159YZPR; PACKAGE_DESIGNATOR: YZP; PART_NO: TS3A24159YZPR; PIN_COUNT: 10; VENDOR: Texas Instruments
U4 U204 U205 = Switches:LOADSWITCH-MIC9416: Micrel 3A High-side Load Switch with Reverse Blocking http://ww1.microchip.com/downloads/en/DeviceDoc/MIC9416x.pdf https://www.digikey.com/product-detail/en/microchip-technology/MIC94162YCS-TR/576-4508-1-ND/4732487; MANUFACTURER: Microchip Technology; MPN: MIC94164YCS-TR; PART_NO: MIC94164YCS-TR; PART_NUMBER: MIC94164; QUENCH: YES; SOFTSTART: YES
U5 = Diodes:PD3S140-7: 1A Schottky Barrier Rectifier. Low reverse bias current. Datasheet: https://www.diodes.com/assets/Datasheets/ds30862.pdf; PART_NO: PD3S140-7; VENDOR: Diodes Inc
U101 = Processors:ATSAMD51: Device for the ATSAM-D51 ARM Cortex-M4F microcontroller, in the TFBGA120 package; DIGI-KEY_PART_NUMBER: ATSAMD51P20A-CTUTCT-ND; DIGI-KEY_PURCHASE_URL: https://www.digikey.com/product-detail/en/ATSAMD51P20A-CTUT/ATSAMD51P20A-CTUTCT-ND/8594973?utm_campaign=buynow&WT.z_cid=ref_octopart_dkc_buynow&utm_medium=aggregator&curr=usd&site=us&utm_source=octopart; MF: Microchip; MP: ATSAMD51P20A-CTUT; PACKAGE: 120-TFBGA; PART_NO: ATSAMD51P20A-CTUT
U201 = CoulombCounters:COULOMB-MAX17262: 5.2 uA 1-Cell Fuel Gauge with ModelGauge m5 EZ and Internal Current Sensing; MANUFACTURER: Maxim Integrated; MP: MAX17262REWL+T; MPN: MAX17262REWL+T; PART_NO: MAX17262REWL+T
U202 = Regulators:MAX77827BEWC+T: Maxim 77827 Buck-Boost regulator The MAX77827 is a high-efficiency buck-boost regulator targeted for one-cell Li-ion powered applications with the lowest typical quiescent current in the industry of 6μA. It supports input voltages of 1.8V to 5.5V and an output volt- age range of 2.3V to 5.3V. The IC provides two different switching current levels (1.8A and 3.1A) to optimize ex- ternal component sizing based on given load current re- quirements. With the 1.8A switching current-limit option, the IC can support up to 1.0A load current in buck mode and 900mA in boost mode (VIN = 3.0V, VOUT = 3.3V).; BUILT_BY: EMA_Molly; COPYRIGHT: Copyright (C) 2018 Accelerated Designs. All rights reserved; MANUFACTURER: Maxim; MANUFACTURER_PART_NUMBER: MAX77827BEWC+T; MPN: MAX77827BEWC+; PART_NO: MAX77827BEWC+T; VENDOR: Maxim Integrated Products
U203 = Sensors:SENSOR-SI7006: I2C Humidity and Temperature Sensor; MANUFACTURER: Silicon Laboratories; MPN: SI7021-A20-GM1R; PART_NO: SI7021-A20-GM1R
Y102 = Oscillators:ABS07-32.768KHZ-9-T: ABS07 Series 32.768 kHz ±20 ppm 9 pF -40 to +85 C SMT Low Profile Crystal; DESCRIPTION: 32.768kHz ±20ppm Crystal 9pF 70 kOhms 2-SMD, No Lead; MF: Abracon; MP: ABS07-32.768KHZ-9-T; PACKAGE: SMD-2 Abracon; PART_NO: ABS07-32.768KHZ-9-T

## Net classes
1 power_3v3: width 0.254 mm
5 10_mil: width 0.254 mm